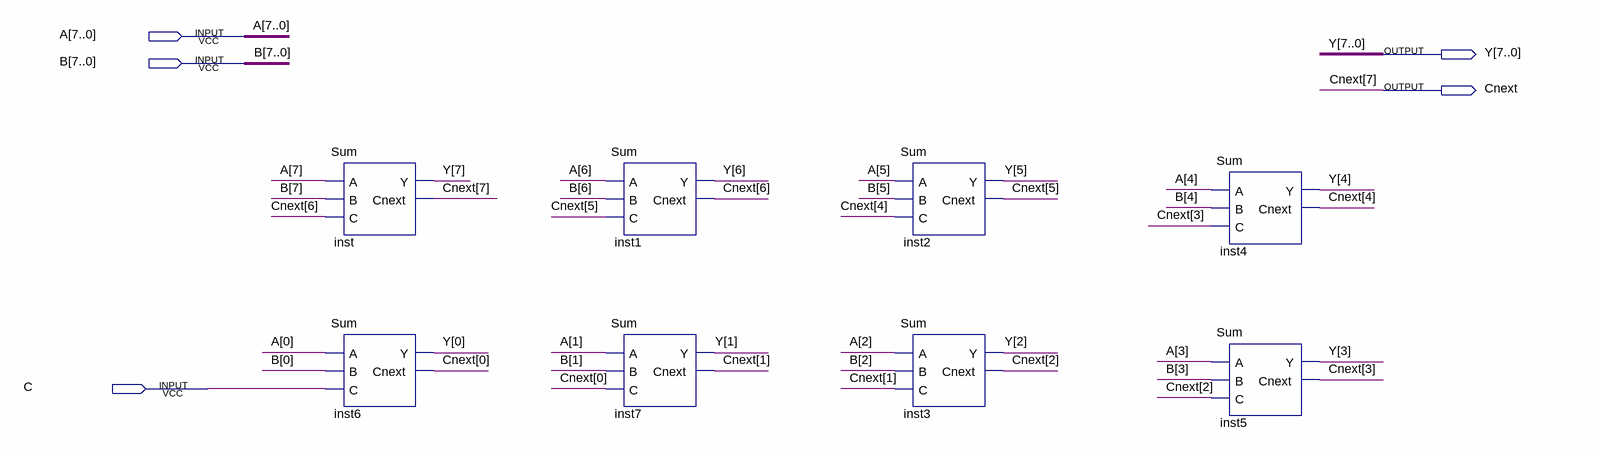
[diagram p0: schematic sheet]
// Quartus schematic Sum8Bit.bdf as structural Verilog: 8 symbols, 5 pins
module Sum8Bit (
  input  [7:0] A,
  input  [7:0] B,
  input  C,
  output [7:0] Y,
  output Cnext
);

  wire [6:0] Cnext_bus;

  Sum inst (.A(A[7]), .B(B[7]), .C(Cnext_bus[6]), .Y(Y[7]), .Cnext(Cnext));
  Sum inst6 (.A(A[0]), .B(B[0]), .C(C), .Y(Y[0]), .Cnext(Cnext_bus[0]));
  Sum inst1 (.A(A[6]), .B(B[6]), .C(Cnext_bus[5]), .Y(Y[6]), .Cnext(Cnext_bus[6]));
  Sum inst7 (.A(A[1]), .B(B[1]), .C(Cnext_bus[0]), .Y(Y[1]), .Cnext(Cnext_bus[1]));
  Sum inst2 (.A(A[5]), .B(B[5]), .C(Cnext_bus[4]), .Y(Y[5]), .Cnext(Cnext_bus[5]));
  Sum inst3 (.A(A[2]), .B(B[2]), .C(Cnext_bus[1]), .Y(Y[2]), .Cnext(Cnext_bus[2]));
  Sum inst4 (.A(A[4]), .B(B[4]), .C(Cnext_bus[3]), .Y(Y[4]), .Cnext(Cnext_bus[4]));
  Sum inst5 (.A(A[3]), .B(B[3]), .C(Cnext_bus[2]), .Y(Y[3]), .Cnext(Cnext_bus[3]));

  // Other names for the same wires on the sheet: Cnext[7] = Cnext
endmodule
